# EAGLE design Co2Det (EAGLE 9.6.2)
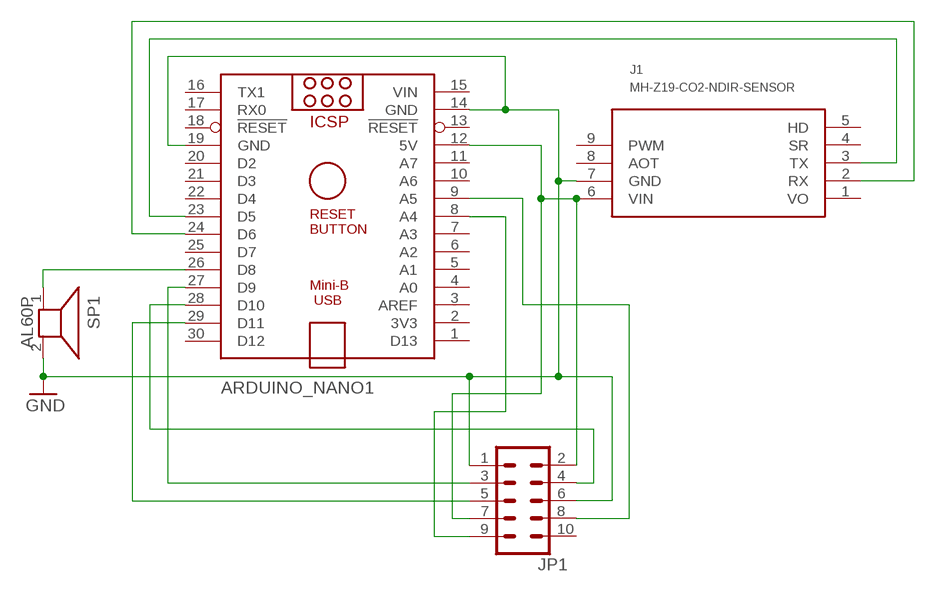
[diagram p0: schematic, sheet 1]

## Parts
ARDUINO_NANO1  ARDUINO_NANO  [ARDUINO_NANO]
J1  MH-Z19-CO2-NDIR-SENSOR  [MH-Z19]
JP1  ML10L  [ML10L]
SP1  AL60P  [AL60P]

## Nets
GND: ARDUINO_NANO1.14(GND) ARDUINO_NANO1.19(GND) J1.7(GND) JP1.1 JP1.6 SP1.2
N$2: ARDUINO_NANO1.12(5V) J1.6(VIN) JP1.2 JP1.7
N$3: ARDUINO_NANO1.27(D9) JP1.3
N$4: ARDUINO_NANO1.28(D10) JP1.4
N$5: ARDUINO_NANO1.29(D11) JP1.5
N$6: ARDUINO_NANO1.23(D5) J1.3(TX)
N$7: ARDUINO_NANO1.24(D6) J1.2(RX)
N$8: ARDUINO_NANO1.8(A4) JP1.9
N$9: ARDUINO_NANO1.9(A5) JP1.8
N$10: ARDUINO_NANO1.26(D8) SP1.1
Unconnected: ARDUINO_NANO1.1(D13) ARDUINO_NANO1.2(3V3) ARDUINO_NANO1.3(AREF) ARDUINO_NANO1.4(A0) ARDUINO_NANO1.5(A1) ARDUINO_NANO1.6(A2) ARDUINO_NANO1.7(A3) ARDUINO_NANO1.10(A6) ARDUINO_NANO1.11(A7) ARDUINO_NANO1.13(!RESET) ARDUINO_NANO1.16(TX1) ARDUINO_NANO1.17(RX0) ARDUINO_NANO1.18(!RESET) ARDUINO_NANO1.20(D2) ARDUINO_NANO1.21(D3) ARDUINO_NANO1.22(D4) ARDUINO_NANO1.25(D7) ARDUINO_NANO1.30(D12) J1.4(SR) J1.5(HD) J1.8(AOT) J1.9(PWM) JP1.10

## Power pins joined to a net without a drawn wire
VIN: ARDUINO_NANO1.15(VIN)
VO: J1.1(VO)

## Library data of the parts
ARDUINO_NANO1 = ArduinoNanoV30:ARDUINO_NANO: Arduino Nano V3.0 Overview: The Arduino Nano is a small, complete, and breadboard-friendly board based on the ATmega328 (Arduino Nano 3.x) or ATmega168 (Arduino Nano 2.x). It has more or less the same functionality of the Arduino Duemilanove, but in a different package. It lacks only a DC power jack, and works with a Mini-B USB cable instead of a standard one. The Nano was designed and is being produced by Gravitech. Specifications: Microcontroller Atmel ATmega168 or ATmega328 Operating Voltage (logic level) 5 V Input Voltage (recommended) 7-12 V Input Voltage (limits) 6-20 V Digital I/O Pins 14 (of which 6 provide PWM output) Analog Input Pins 8 DC Current per I/O Pin 40 mA Flash Memory 16 KB (ATmega168) or 32 KB (ATmega328) of which 2 KB used by bootloader SRAM 1 KB (ATmega168) or 2 KB (ATmega328) EEPROM 512 bytes (ATmega168) or 1 KB (ATmega328) Clock Speed 16 MHz Dimensions 0.73" x 1.70" Length 45 mm Width 18 mm Weigth 5 g Power: The Arduino Nano can be powered via the Mini-B USB connection, 6-20V unregulated external power supply (pin 30), or 5V regulated external power supply (pin 27). The power source is automatically selected to the highest voltage source. Memory: The ATmega168 has 16 KB of flash memory for storing code (of which 2 KB is used for the bootloader); the ATmega328 has 32 KB, (also with 2 KB used for the bootloader). The ATmega168 has 1 KB of SRAM and 512 bytes of EEPROM (which can be read and written with the EEPROM library); the ATmega328 has 2 KB of SRAM and 1 KB of EEPROM. Input and Output: Each of the 14 digital pins on the Nano can be used as an input or output, using pinMode(), digitalWrite(), and digitalRead() functions. They operate at 5 volts. Each pin can provide or receive a maximum of 40 mA and has an internal pull-up resistor (disconnected by default) of 20-50 kOhms. In addition, some pins have specialized functions. Visit Arduino - ArduinoBoardNano <https://www.arduino.cc/en/Main/ArduinoBoardNano>
J1 = mh-z19:MH-Z19: MH-Z19 - CO2 NDIR SENSOR
JP1 = con-ml:ML10L: HARTING; OC_FARNELL: unknown; OC_NEWARK: unknown
SP1 = buzzer:AL60P: SPEAKER Source: Buerklin; OC_FARNELL: unknown; OC_NEWARK: unknown

## Board
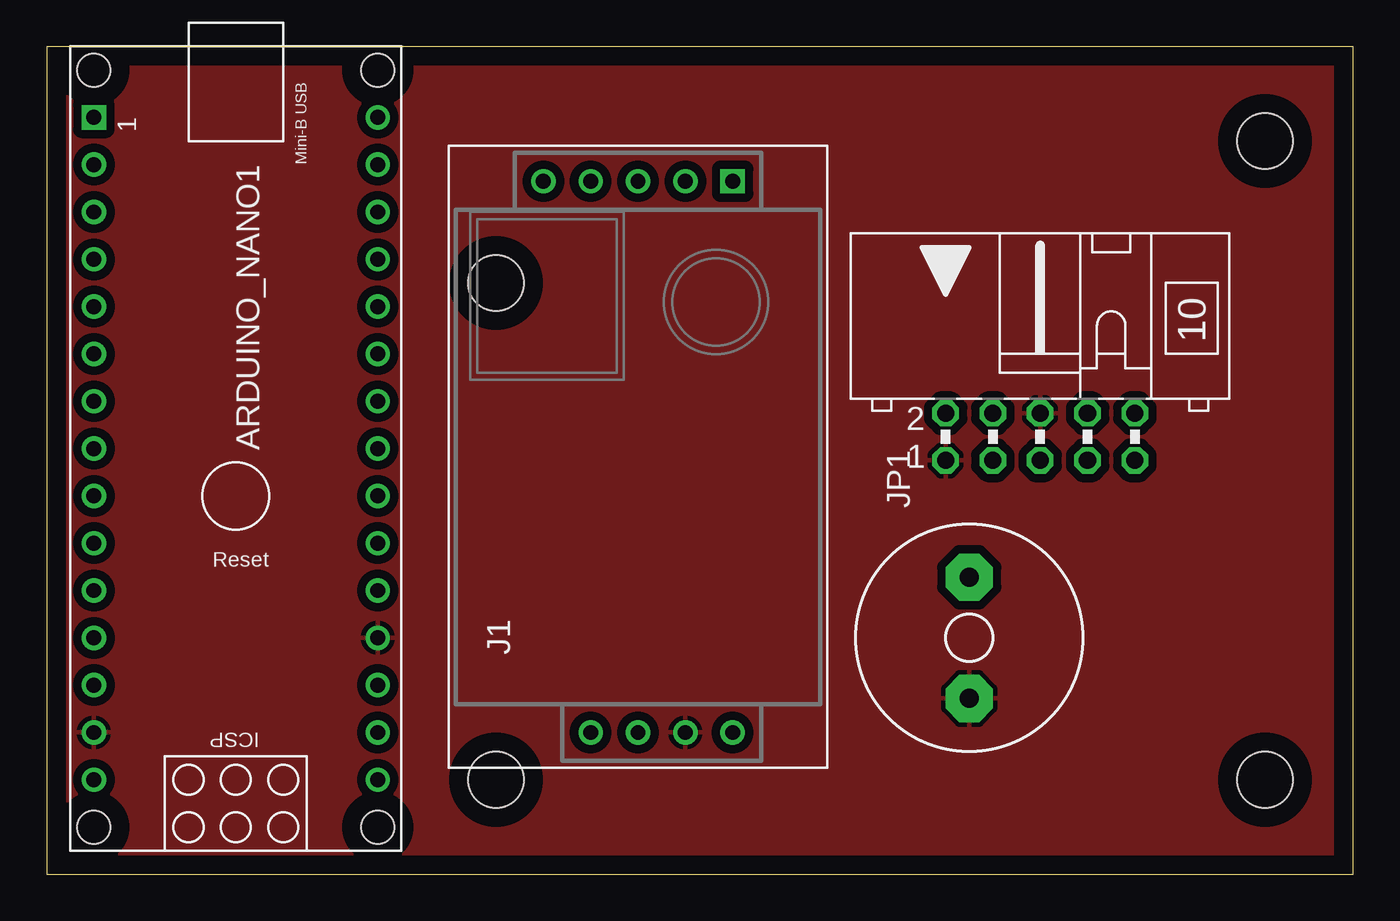
[diagram p1: board, top side]
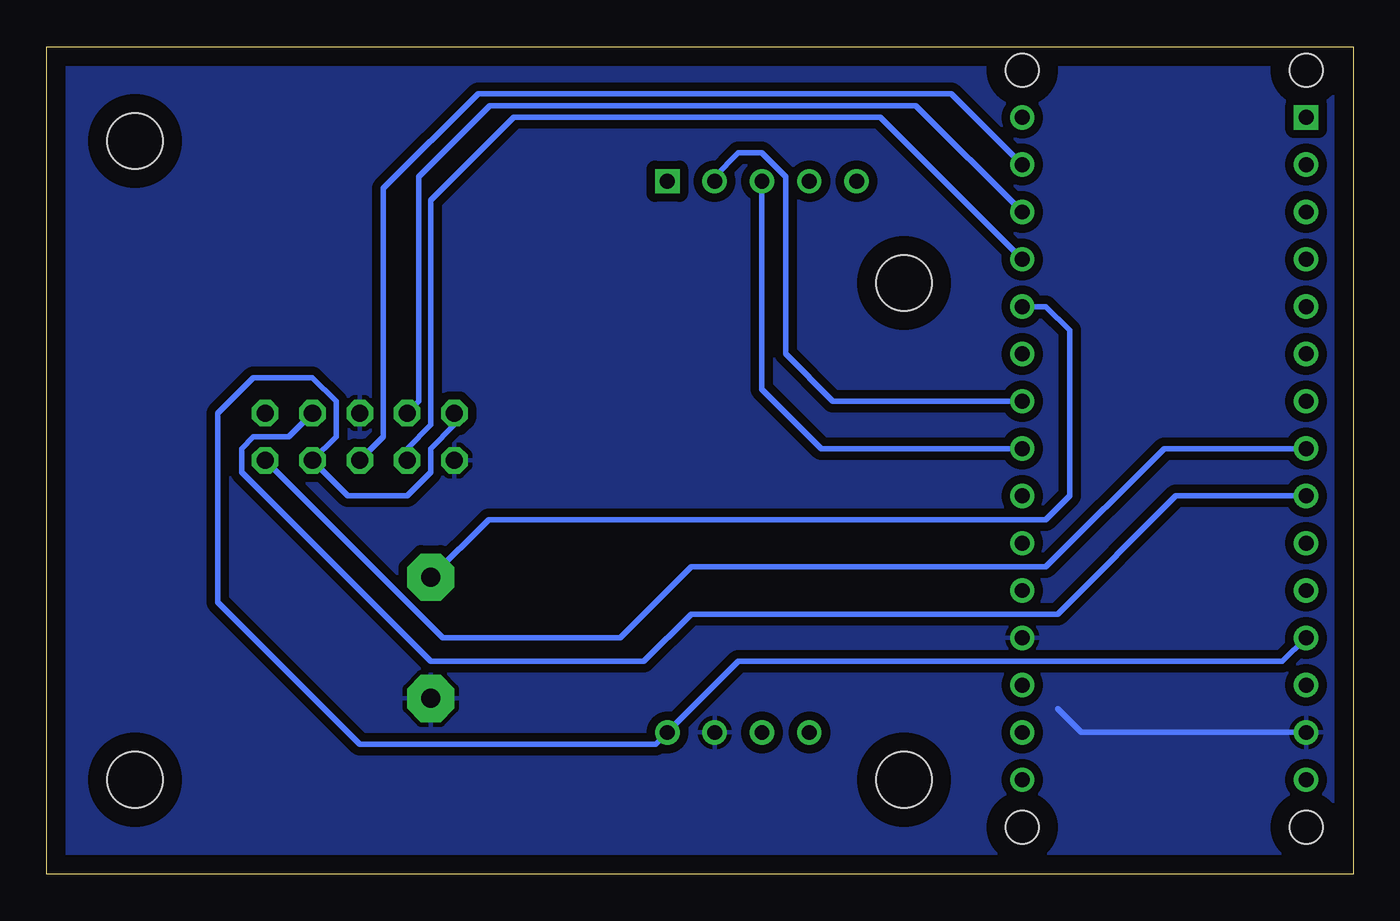
[diagram p2: board, bottom side, seen from below]

Size 70.16 x 44.44 mm. Coordinates in mm from the lower left corner, seen from the top.
Outline: 0,0 70.16,0 70.16,44.44 0,44.44 0,0
Copper layers (1*16): Top 0.035mm / dielectric 1.5mm / Bottom 0.035mm
Design rules "default": minimum track width 6mil, minimum drill 0.35mm, track to track 6mil, track to pad 6mil, pad to pad 6mil, via to via 6mil, smd to smd 6mil, copper to edge 40mil, drill to drill 6mil, minimum pad ring 10mil, minimum via ring 8mil, stop-mask expansion 4mil, vias tented up to drill 0mil, thermal gap 10mil
Holes 3 mm at 65.41,5.08 65.41,39.37 24.13,5.08 24.13,31.75

### Footprints (pad centres in the part's own frame; a part is rotated, then mirrored left to right if it is on the bottom)
ARDUINO_NANO = drill 0.8 square: 1 -20.32,-7.62 | drill 0.8: 2 -17.78,-7.62; 3 -15.24,-7.62; 4 -12.7,-7.62; 5 -10.16,-7.62; 6 -7.62,-7.62; 7 -5.08,-7.62; 8 -2.54,-7.62; 9 0,-7.62; 10 2.54,-7.62; 11 5.08,-7.62; 12 7.62,-7.62; 13 10.16,-7.62; 14 12.7,-7.62; 15 15.24,-7.62; 16 15.24,7.62; 17 12.7,7.62; 18 10.16,7.62; 19 7.62,7.62; 20 5.08,7.62; 21 2.54,7.62; 22 0,7.62; 23 -2.54,7.62; 24 -5.08,7.62; 25 -7.62,7.62; 26 -10.16,7.62; 27 -12.7,7.62; 28 -15.24,7.62; 29 -17.78,7.62; 30 -20.32,7.62 | hole 1.778: -22.86,-7.62; -22.86,7.62; 17.78,7.62; 17.78,-7.62
MH-Z19 = drill 0.8 square: 1 29.591,0 | drill 0.8: 2 29.591,2.54; 3 29.591,5.08; 4 29.591,7.62; 5 29.591,10.16; 6 0,0; 7 0,2.54; 8 0,5.08; 9 0,7.62
ML10L = drill 0.914 octagon: 1 -5.08,-1.27; 2 -5.08,1.27; 3 -2.54,-1.27; 4 -2.54,1.27; 5 0,-1.27; 6 0,1.27; 7 2.54,-1.27; 8 2.54,1.27; 9 5.08,-1.27; 10 5.08,1.27
AL60P = drill 1.016 pad 2.54 octagon: 1 -3.251,0; 2 3.251,0

### Placement (x,y rotation side)
ARDUINO_NANO1  10.16,20.32 270 top
J1  36.83,7.62 90 top
JP1  53.34,23.5 0 top
SP1  49.53,12.7 270 top

### Tracks (layer width: path | path; a pad name or v marks a point on that pad's centre or on a via)
GND
  Bottom 0.305: ARDUINO_NANO1.14 14.61,7.62 15.88,8.89
  pour Bottom (isolate 0.457): 0,44.45 0,0 70.48,0 70.48,44.45
  pour Top (isolate 0.457): 0,0 70.48,0 70.48,45.09 0,45.09
N$2
  Bottom 0.305: ARDUINO_NANO1.12 3.81,11.43 33.02,11.43 J1.6 37.47,6.99 53.34,6.99 60.96,14.61 60.96,24.77 59.05,26.67 55.88,26.67 54.61,25.4 54.61,23.5 JP1.7 53.98,20.32 50.8,20.32 49.53,21.59 49.53,22.86 48.26,24.13 JP1.2
N$3
  Bottom 0.305: ARDUINO_NANO1.27 25.4,40.64 45.09,40.64 49.53,36.2 49.53,24.13 50.8,22.86 JP1.3
N$4
  Bottom 0.305: ARDUINO_NANO1.28 23.5,41.27 46.35,41.27 50.16,37.47 50.16,25.4 JP1.4
N$5
  Bottom 0.305: ARDUINO_NANO1.29 21.59,41.91 46.99,41.91 52.07,36.83 52.07,23.5 JP1.5
N$6
  Bottom 0.305: ARDUINO_NANO1.23 28.57,22.86 31.75,26.04 J1.3
N$7
  Bottom 0.305: ARDUINO_NANO1.24 27.94,25.4 30.48,27.94 30.48,37.47 31.75,38.73 33.02,38.73 34.29,37.47 J1.2
N$8
  Bottom 0.305: ARDUINO_NANO1.8 10.16,22.86 16.51,16.51 35.56,16.51 39.37,12.7 48.9,12.7 JP1.9
N$9
  Bottom 0.305: ARDUINO_NANO1.9 9.53,20.32 15.88,13.97 35.56,13.97 38.1,11.43 49.53,11.43 59.69,21.59 59.69,22.86 59.05,23.5 57.15,23.5 JP1.8
N$10
  Bottom 0.305: ARDUINO_NANO1.26 16.51,30.48 15.24,29.21 15.24,20.32 16.51,19.05 46.43,19.05 SP1.1